# EAGLE schematic RGB_HDMI (EAGLE 6.6.0)
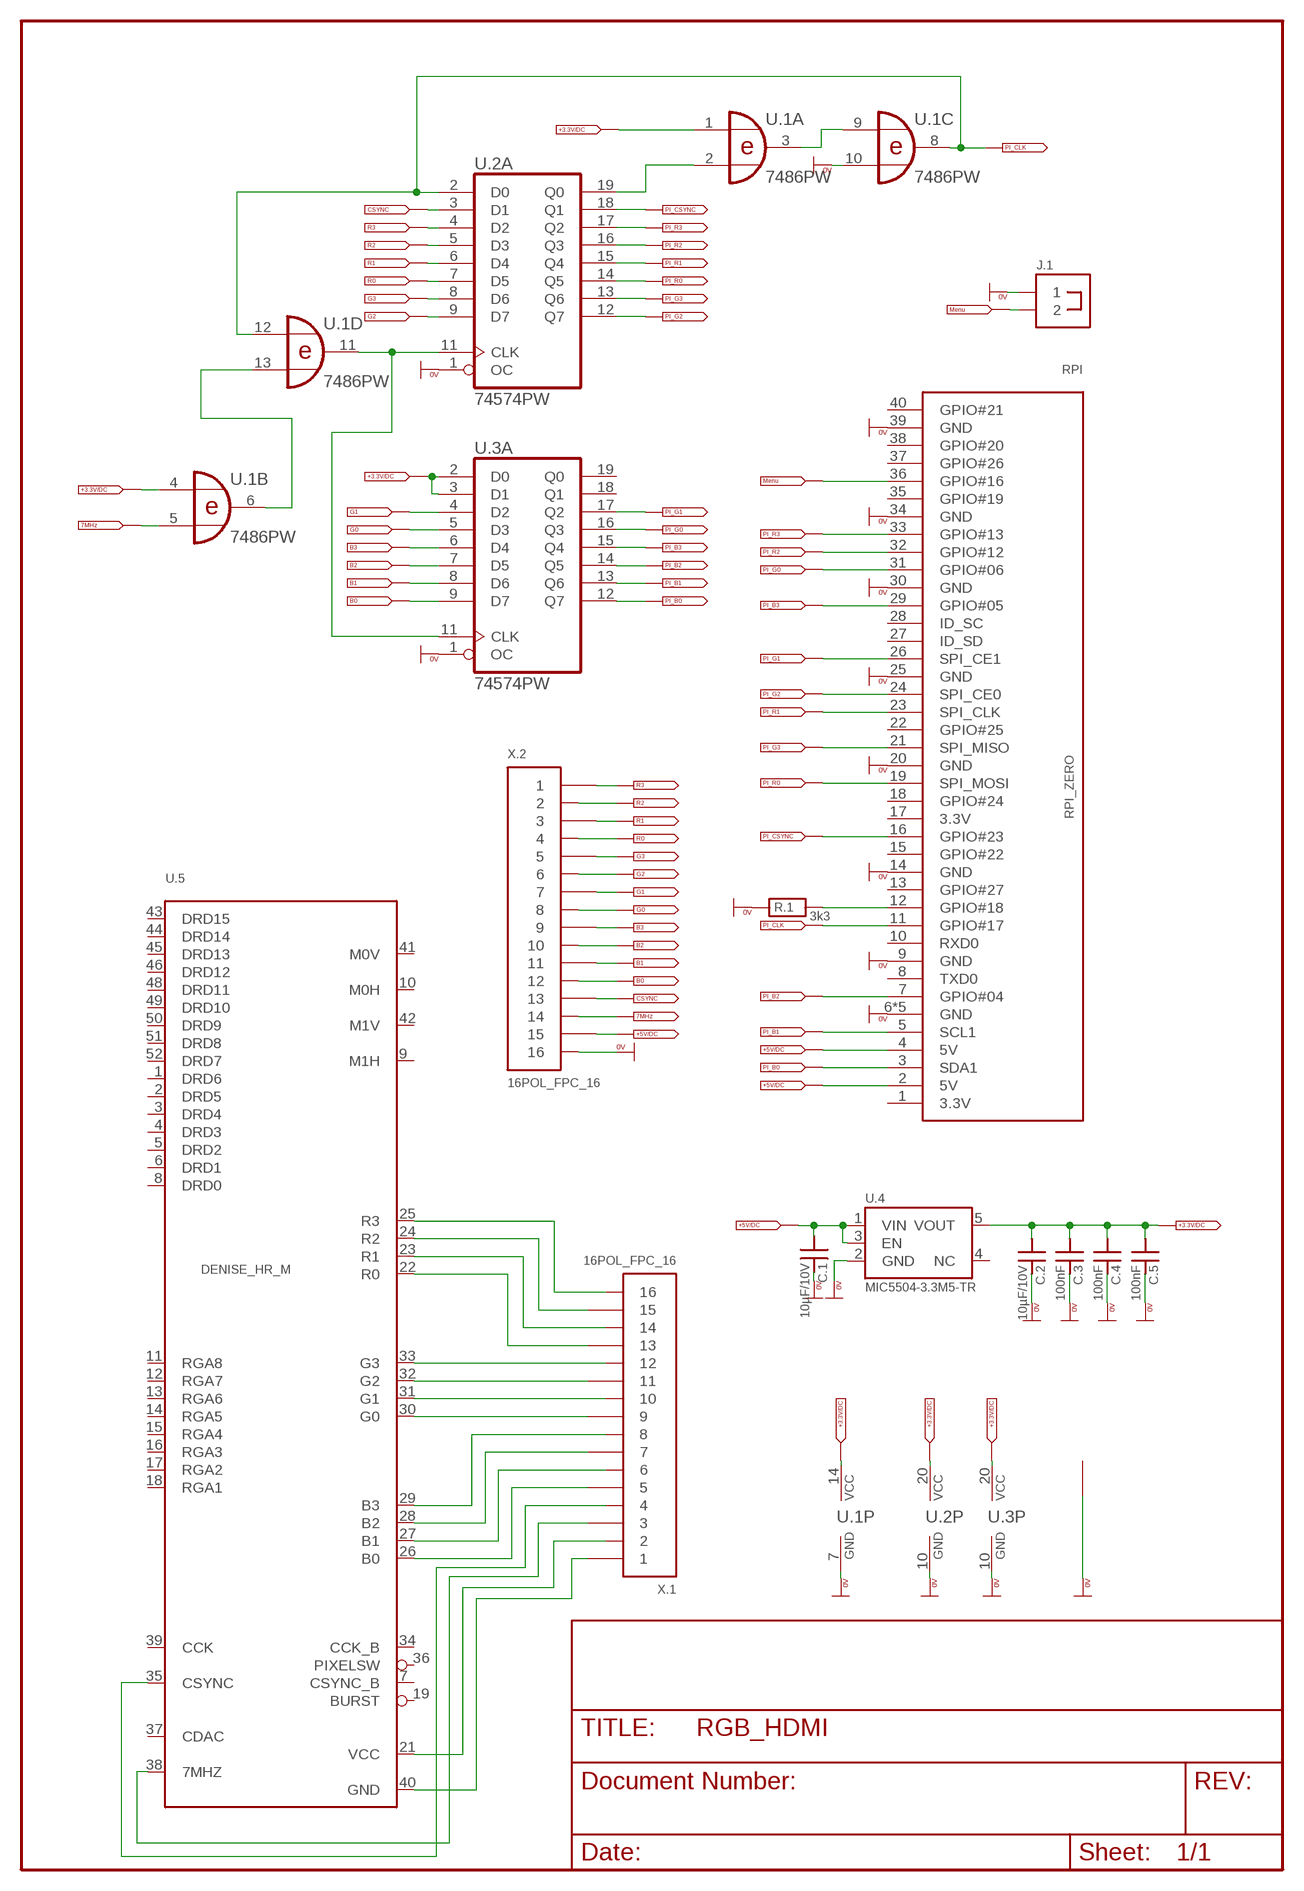
[diagram p0: schematic, sheet 1]

## Parts
C.1  10µF/10V  CAPACITOR_SMD_0805  [0805]
C.2  10µF/10V  CAPACITOR_SMD_0805  [0805]
C.3  100nF  CAPACITOR_SMD_0805  [0805]
C.4  100nF  CAPACITOR_SMD_0805  [0805]
C.5  100nF  CAPACITOR_SMD_0805  [0805]
J.1  2POLIG_1REIHIG  [2POLIG_1REIHIG]
K.1  PAD_1,0SQ  [1,0SQ]
R.1  3k3  RESISTOR_SMD_0805  [0805]
RPI  RPI_ZERO  [RPI_ZERO_FULL]
U.1  7486PW  [TSSOP14]
U.2  74574PW  [TSSOP20]
U.3  74574PW  [TSSOP20]
U.4  MIC5504-3.3M5-TR  TLV755P  [SOT23-5]
U.5  DENISE_HR_M  [PLCC_52_MIRROR]
X.1  16POL_FPC_16  [MOLEX_FPC_16]
X.2  16POL_FPC_16  [MOLEX_FPC_16]

## Nets
0V: C.1.2 C.2.2 C.3.2 C.4.2 C.5.2 J.1.1 K.1.P$1 R.1.1 RPI.6(GND) RPI.9(GND) RPI.14(GND) RPI.20(GND) RPI.25(GND) RPI.30(GND) RPI.34(GND) RPI.39(GND) RPI.P$1(GND) RPI.P$2(GND) RPI.P$3(GND) RPI.P$4(GND) U.1.7(P:GND) U.1.10(C:I1) U.2.1(A:OC) U.2.10(P:GND) U.3.1(A:OC) U.3.10(P:GND) U.4.2(GND) X.2.16
7MHZ: U.1.5(B:I1) X.2.14 ; supply symbol labelled 7MHz
+3.3V: C.2.1 C.3.1 C.4.1 C.5.1 U.1.1(A:I0) U.1.4(B:I0) U.1.14(P:VCC) U.2.20(P:VCC) U.3.2(A:D0) U.3.3(A:D1) U.3.20(P:VCC) U.4.5(VOUT) ; supply symbol labelled +3.3V-IN, +3.3V-OUT
+5V: C.1.1 RPI.2(5V) RPI.4(5V) U.4.1(VIN) U.4.3(EN) X.2.15 ; supply symbol labelled +5V-IN, +5V-OUT
B0: U.3.9(A:D7) X.2.12
B1: U.3.8(A:D6) X.2.11
B2: U.3.7(A:D5) X.2.10
B3: U.3.6(A:D4) X.2.9
CSYNC: U.2.3(A:D1) X.2.13
G0: U.3.5(A:D3) X.2.8
G1: U.3.4(A:D2) X.2.7
G2: U.2.9(A:D7) X.2.6
G3: U.2.8(A:D6) X.2.5
GND: U.5.40(GND) X.1.1
MENUE: J.1.2 RPI.36(GPIO#16) ; supply symbol labelled Menu
N$1: U.1.6(B:O) U.1.13(D:I1)
N$2: U.5.25(R3) X.1.16
N$3: U.5.24(R2) X.1.15
N$4: U.5.23(R1) X.1.14
N$5: U.5.22(R0) X.1.13
N$6: U.1.11(D:O) U.2.11(A:CLK) U.3.11(A:CLK)
N$7: U.1.2(A:I1) U.2.19(A:Q0)
N$8: U.1.3(A:O) U.1.9(C:I0)
N$9: U.5.30(G0) X.1.9
N$10: U.5.31(G1) X.1.10
N$11: U.5.32(G2) X.1.11
N$12: U.5.33(G3) X.1.12
N$13: U.5.29(B3) X.1.8
N$14: U.5.28(B2) X.1.7
N$15: U.5.27(B1) X.1.6
N$16: U.5.26(B0) X.1.5
N$18: U.5.21(VCC) X.1.2
N$19: U.5.38(7MHZ) X.1.3
N$20: U.5.35(CSYNC) X.1.4
N$37: R.1.2 RPI.12(GPIO#18)
PI_B0: RPI.3(SDA1) U.3.12(A:Q7)
PI_B1: RPI.5(SCL1) U.3.13(A:Q6)
PI_B2: RPI.7(GPIO#04) U.3.14(A:Q5)
PI_B3: RPI.29(GPIO#05) U.3.15(A:Q4)
PI_CLK: RPI.11(GPIO#17) U.1.8(C:O) U.1.12(D:I0) U.2.2(A:D0)
PI_CSYNC: RPI.16(GPIO#23) U.2.18(A:Q1)
PI_G0: RPI.31(GPIO#06) U.3.16(A:Q3)
PI_G1: RPI.26(SPI_CE1) U.3.17(A:Q2)
PI_G2: RPI.24(SPI_CE0) U.2.12(A:Q7)
PI_G3: RPI.21(SPI_MISO) U.2.13(A:Q6)
PI_R0: RPI.19(SPI_MOSI) U.2.14(A:Q5)
PI_R1: RPI.23(SPI_CLK) U.2.15(A:Q4)
PI_R2: RPI.32(GPIO#12) U.2.16(A:Q3)
PI_R3: RPI.33(GPIO#13) U.2.17(A:Q2)
R0: U.2.7(A:D5) X.2.4
R1: U.2.6(A:D4) X.2.3
R2: U.2.5(A:D3) X.2.2
R3: U.2.4(A:D2) X.2.1
Unconnected: RPI.1(3.3V) RPI.8(TXD0) RPI.10(RXD0) RPI.13(GPIO#27) RPI.15(GPIO#22) RPI.17(3.3V) RPI.18(GPIO#24) RPI.22(GPIO#25) RPI.27(ID_SD) RPI.28(ID_SC) RPI.35(GPIO#19) RPI.37(GPIO#26) RPI.38(GPIO#20) RPI.40(GPIO#21) U.3.18(A:Q1) U.3.19(A:Q0) U.4.4(NC) U.5.1(DRD6) U.5.2(DRD5) U.5.3(DRD4) U.5.4(DRD3) U.5.5(DRD2) U.5.6(DRD1) U.5.7(CSYNC_B) U.5.8(DRD0) U.5.9(M1H) U.5.10(M0H) U.5.11(RGA8) U.5.12(RGA7) U.5.13(RGA6) U.5.14(RGA5) U.5.15(RGA4) U.5.16(RGA3) U.5.17(RGA2) U.5.18(RGA1) U.5.19(BURST) U.5.34(CCK_B) U.5.36(PIXELSW) U.5.37(CDAC) U.5.39(CCK) U.5.41(M0V) U.5.42(M1V) U.5.43(DRD15) U.5.44(DRD14) U.5.45(DRD13) U.5.46(DRD12) U.5.48(DRD11) U.5.49(DRD10) U.5.50(DRD9) U.5.51(DRD8) U.5.52(DRD7)

## Library data of the parts
C.1-C.5 = de_discrete:CAPACITOR
J.1 = de_jumper:2POLIG
K.1 = de_loetauge:PAD
R.1 = de_discrete:RESISTOR
RPI = de_controller:RPI_ZERO
U.1 = de_logic:74*86: Quad 2-input EXCLUSIVE-OR (XOR) gate
U.2 U.3 = de_logic:74*574: 8-bit D type FLIP FLOP bus driver
U.4 = de_power:TLV755P
U.5 = Amiga:DENISE_HR
X.1 X.2 = de_connectors:16POL